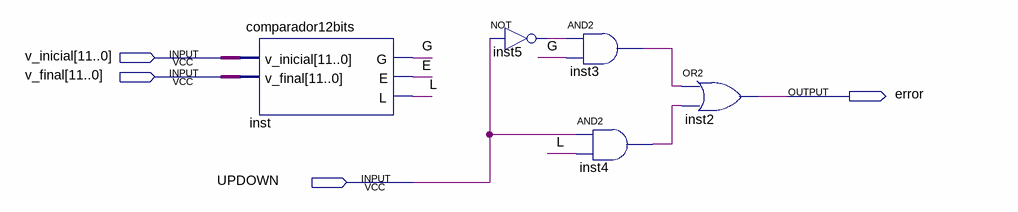
[diagram p0: schematic sheet]
// Quartus schematic validacionInicioFin.bdf as structural Verilog: 5 symbols, 4 pins
module validacionInicioFin (
  input  [11:0] v_inicial,
  input  [11:0] v_final,
  input  UPDOWN,
  output error
);

  wire E, G, inst3_out, inst4_out, inst5_out, L;

  comparador12bits inst (.v_inicial(v_inicial), .v_final(v_final), .G(G), .E(E), .L(L));
  not inst5 (inst5_out, UPDOWN);
  and inst3 (inst3_out, inst5_out, G);
  and inst4 (inst4_out, UPDOWN, L);
  or inst2 (error, inst3_out, inst4_out);
endmodule
